# EAGLE design me433_hw2 (EAGLE 8.1.0)
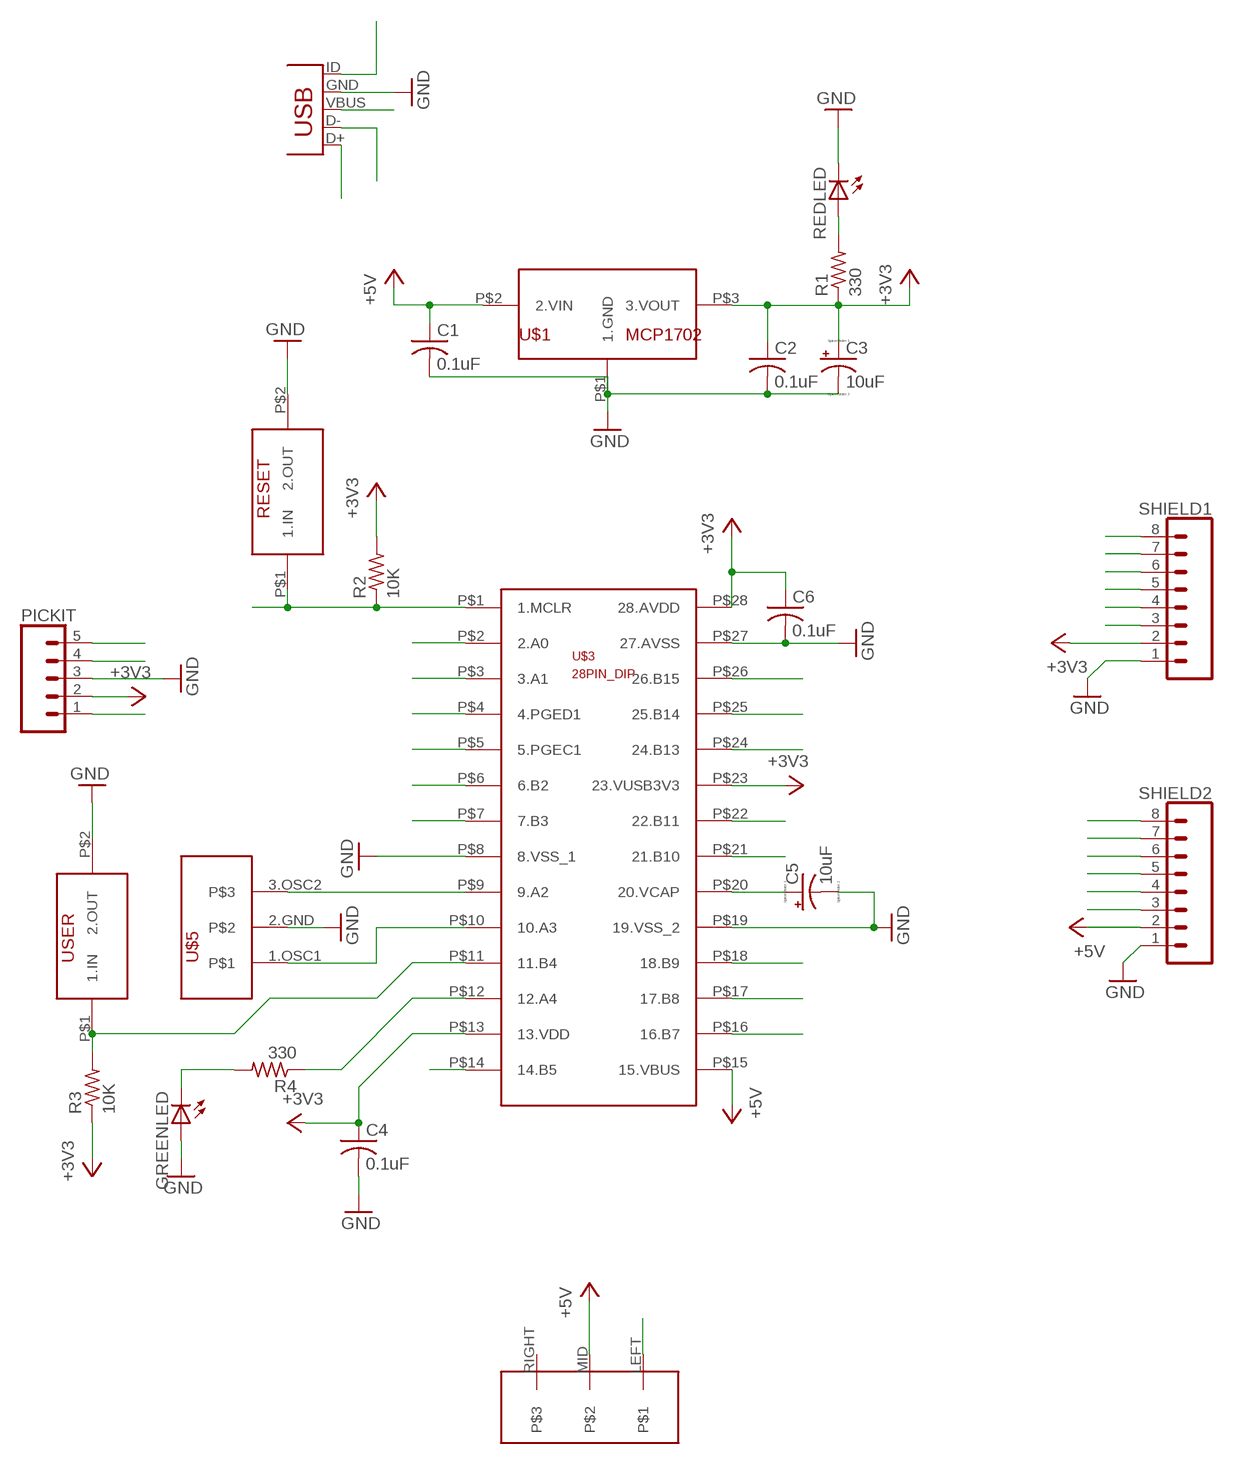
[diagram p0: schematic, sheet 1]

## Parts
C1  0.1uF  C-US025-030X050  [C025-030X050]
C2  0.1uF  C-US025-030X050  [C025-030X050]
C3  10uF  CPOL-USB45181B  [B45181B]
C4  0.1uF  C-US025-030X050  [C025-030X050]
C5  10uF  CPOL-USB45181B  [B45181B]
C6  0.1uF  C-US025-030X050  [C025-030X050]
GREENLED  LED3MM  [LED3MM]
PICKIT  CONN_05  [1X05]
R1  330  R-US_0207/10  [0207/10]
R2  10K  R-US_0207/10  [0207/10]
R3  10K  R-US_0207/10  [0207/10]
R4  330  R-US_0207/10  [0207/10]
REDLED  LED3MM  [LED3MM]
RESET  PUSH_BUTTON  [PUSH_BUTTON]
SHIELD1  CONN_08"  [1X08]
SHIELD2  CONN_08"  [1X08]
U$1  MCP1702  [MCP1702]
U$2  USBMINIB  [USB-MB-H]
U$3  28PIN_DIP  [28PIN_DIP]
U$4  SLIDE_SWITCH  [SLIDE_SWITCH]
U$5  RESONATOR  [RESONATOR]
USER  PUSH_BUTTON  [PUSH_BUTTON]

## Nets
+3V3: C2.1 C3.+ C4.1 C6.1 PICKIT.2 R1.1 R2.2 R3.1 SHIELD1.2 U$1.P$3(3.VOUT) U$3.P$13(13.VDD) U$3.P$23(23.VUSB3V3) U$3.P$28(28.AVDD)
+5V: C1.1 SHIELD2.2 U$1.P$2(2.VIN) U$3.P$15(15.VBUS) U$4.MID
A0: SHIELD1.8 U$3.P$2(2.A0)
A1: SHIELD1.7 U$3.P$3(3.A1)
A4: R4.1 SHIELD1.3 U$3.P$12(12.A4)
B2: SHIELD1.6 U$3.P$6(6.B2)
B3: SHIELD1.5 U$3.P$7(7.B3)
B4: R3.2 SHIELD1.4 U$3.P$11(11.B4) USER.P$1(1.IN)
B7: SHIELD2.3 U$3.P$16(16.B7)
B8: SHIELD2.4 U$3.P$17(17.B8)
B9: SHIELD2.5 U$3.P$18(18.B9)
B13: SHIELD2.6 U$3.P$24(24.B13)
B14: SHIELD2.7 U$3.P$25(25.B14)
B15: SHIELD2.8 U$3.P$26(26.B15)
D+: U$2.D+ U$3.P$21(21.B10)
D-: U$2.D- U$3.P$22(22.B11)
GND: C1.2 C2.2 C3.- C4.2 C5.- C6.2 GREENLED.A PICKIT.3 REDLED.K(C) RESET.P$2(2.OUT) SHIELD1.1 SHIELD2.1 U$1.P$1(1.GND) U$2.GND U$3.P$8(8.VSS_1) U$3.P$19(19.VSS_2) U$3.P$27(27.AVSS) U$5.2.GND USER.P$2(2.OUT)
MCLR: PICKIT.1 R2.1 RESET.P$1(1.IN) U$3.P$1(1.MCLR)
N$1: R1.2 REDLED.A
N$2: U$3.P$9(9.A2) U$5.3.OSC2
N$3: U$3.P$10(10.A3) U$5.1.OSC1
N$4: C5.+ U$3.P$20(20.VCAP)
N$6: GREENLED.K(C) R4.2
PGC1: PICKIT.5 U$3.P$5(5.PGEC1)
PGD1: PICKIT.4 U$3.P$4(4.PGED1)
SLIDESWITCH: U$2.VBUS U$4.LEFT
USBID: U$2.ID(USBID) U$3.P$14(14.B5)
Unconnected: U$4.RIGHT

## Library data of the parts
C1 C2 C4 C6 = resistor:C-US: CAPACITOR, American symbol
C3 C5 = resistor:CPOL-US: POLARIZED CAPACITOR, American symbol
GREENLED REDLED = led:LED: LED OSRAM: - CHIPLED LG R971, LG N971, LY N971, LG Q971, LY Q971, LO R971, LY R971 LH N974, LH R974 LS Q976, LO Q976, LY Q976 LO Q996 - Hyper CHIPLED LW Q18S LB Q993, LB Q99A, LB R99A - SideLED LS A670, LO A670, LY A670, LG A670, LP A670 LB A673, LV A673, LT A673, LW A673 LH A674 LY A675 LS A676, LA A676, LO A676, LY A676, LW A676 LS A679, LY A679, LG A679 - Hyper Micro SIDELED® LS Y876, LA Y876, LO Y876, LY Y876 LT Y87S - SmartLED LW L88C, LW L88S LB L89C, LB L89S, LG L890 LS L89K, LO L89K, LY L89K LS L896, LA L896, LO L896, LY L896 - TOPLED LS T670, LO T670, LY T670, LG T670, LP T670 LSG T670, LSP T670, LSY T670, LOP T670, LYG T670 LG T671, LOG T671, LSG T671 LB T673, LV T673, LT T673, LW T673 LH T674 LS T676, LA T676, LO T676, LY T676, LB T676, LH T676, LSB T676, LW T676 LB T67C, LV T67C, LT T67C, LS T67K, LO T67K, LY T67K, LW E67C LS E67B, LA E67B, LO E67B, LY E67B, LB E67C, LV E67C, LT E67C LW T67C LS T679, LY T679, LG T679 LS T770, LO T770, LY T770, LG T770, LP T770 LB T773, LV T773, LT T773, LW T773 LH T774 LS E675, LA E675, LY E675, LS T675 LS T776, LA T776, LO T776, LY T776, LB T776 LHGB T686 LT T68C, LB T68C - Hyper Mini TOPLED® LB M676 - Mini TOPLED Santana® LG M470 LS M47K, LO M47K, LY M47K Source: http://www.osram.convergy.de LUXEON: - LUMILED® LXK2-PW12-R00, LXK2-PW12-S00, LXK2-PW14-U00, LXK2-PW14-V00 LXK2-PM12-R00, LXK2-PM12-S00, LXK2-PM14-U00 LXK2-PE12-Q00, LXK2-PE12-R00, LXK2-PE12-S00, LXK2-PE14-T00, LXK2-PE14-U00 LXK2-PB12-K00, LXK2-PB12-L00, LXK2-PB12-M00, LXK2-PB14-N00, LXK2-PB14-P00, LXK2-PB14-Q00 LXK2-PR12-L00, LXK2-PR12-M00, LXK2-PR14-Q00, LXK2-PR14-R00 LXK2-PD12-Q00, LXK2-PD12-R00, LXK2-PD12-S00 LXK2-PH12-R00, LXK2-PH12-S00 LXK2-PL12-P00, LXK2-PL12-Q00, LXK2-PL12-R00 Source: www.luxeon.com KINGBRIGHT: KA-3528ASYC Source: www.kingbright.com
PICKIT = SparkFun-Connectors:CONN_05: Multi connection point. Often used as Generic Header-pin footprint for 0.1 inch spaced/style header connections On any of the 0.1 inch spaced packages, you can populate with these: Break Away Headers - Straight <https://www.sparkfun.com/products/116> (PRT-00116) Break Away Male Headers - Right Angle <https://www.sparkfun.com/products/553> (PRT-00553) Female Headers <https://www.sparkfun.com/products/115> (PRT-00115) Break Away Headers - Machine Pin <https://www.sparkfun.com/products/117> (PRT-00117) Break Away Female Headers - Swiss Machine Pin <https://www.sparkfun.com/products/743> (PRT-00743) For SCREWTERMINALS and SPRING TERMINALS visit here: Screw Terimnals on SparkFun.com <https://www.sparkfun.com/search/results?term=Screw+Terminals> (5mm/3.5mm/2.54mm spacing) This device is also useful as a general connection point to wire up your design to another part of your project. Our various solder wires solder well into these plated through hole pads. Hook-Up Wire - Assortment (Stranded, 22 AWG) <https://www.sparkfun.com/products/11375> (PRT-11375) Hook-Up Wire - Assortment (Solid Core, 22 AWG) <https://www.sparkfun.com/products/11367> (PRT-11367) View the entire wire category on our website here <https://www.sparkfun.com/categories/141> Special notes: Molex polarized connector foot print use with SKU : PRT-08231 with associated crimp pins and housings. 1MM SMD Version SKU: PRT-10208
R1-R4 = resistor:R-US_: RESISTOR, American symbol
RESET USER = push_button:PUSH_BUTTON
SHIELD1 SHIELD2 = SparkFun-Connectors:CONN_08: Multi connection point. Often used as Generic Header-pin footprint for 0.1 inch spaced/style header connections On any of the 0.1 inch spaced packages, you can populate with these: Break Away Headers - Straight <https://www.sparkfun.com/products/116> (PRT-00116) Break Away Male Headers - Right Angle <https://www.sparkfun.com/products/553> (PRT-00553) Female Headers <https://www.sparkfun.com/products/115> (PRT-00115) Break Away Headers - Machine Pin <https://www.sparkfun.com/products/117> (PRT-00117) Break Away Female Headers - Swiss Machine Pin <https://www.sparkfun.com/products/743> (PRT-00743) Arduino Stackable Header - 8 Pin <https://www.sparkfun.com/products/9279> (PRT-09279) For SCREWTERMINALS and SPRING TERMINALS visit here: Screw Terimnals on SparkFun.com <https://www.sparkfun.com/search/results?term=Screw+Terminals> (5mm/3.5mm/2.54mm spacing) This device is also useful as a general connection point to wire up your design to another part of your project. Our various solder wires solder well into these plated through hole pads. Hook-Up Wire - Assortment (Stranded, 22 AWG) <https://www.sparkfun.com/products/11375> (PRT-11375) Hook-Up Wire - Assortment (Solid Core, 22 AWG) <https://www.sparkfun.com/products/11367> (PRT-11367) View the entire wire category on our website here <https://www.sparkfun.com/categories/141> Special notes: Molex polarized connector foot print use with SKU : PRT-08231 with associated crimp pins and housings. 1MM SMD Version SKU: PRT-10208 NOTES ON THE VARIANTS LOCK and LOCK_LONGPADS... This footprint was designed to help hold the alignment of a through-hole component (i.e. 6-pin header) while soldering it into place. You may notice that each hole has been shifted either up or down by 0.005 of an inch from it's more standard position (which is a perfectly straight line). This slight alteration caused the pins (the squares in the middle) to touch the edges of the holes. Because they are alternating, it causes a "brace" to hold the component in place. 0.005 has proven to be the perfect amount of "off-center" position when using our standard breakaway headers. Although looks a little odd when you look at the bare footprint, once you have a header in there, the alteration is very hard to notice. Also,if you push a header all the way into place, it is covered up entirely on the bottom side.; PROD_ID: CONN-08438
U$1 = MCP1702:MCP1702
U$2 = usbminib:USBMINIB
U$3 = PIC32:28PIN_DIP
U$4 = slide_switch:SLIDE_SWITCH
U$5 = resonator:RESONATOR

## Board
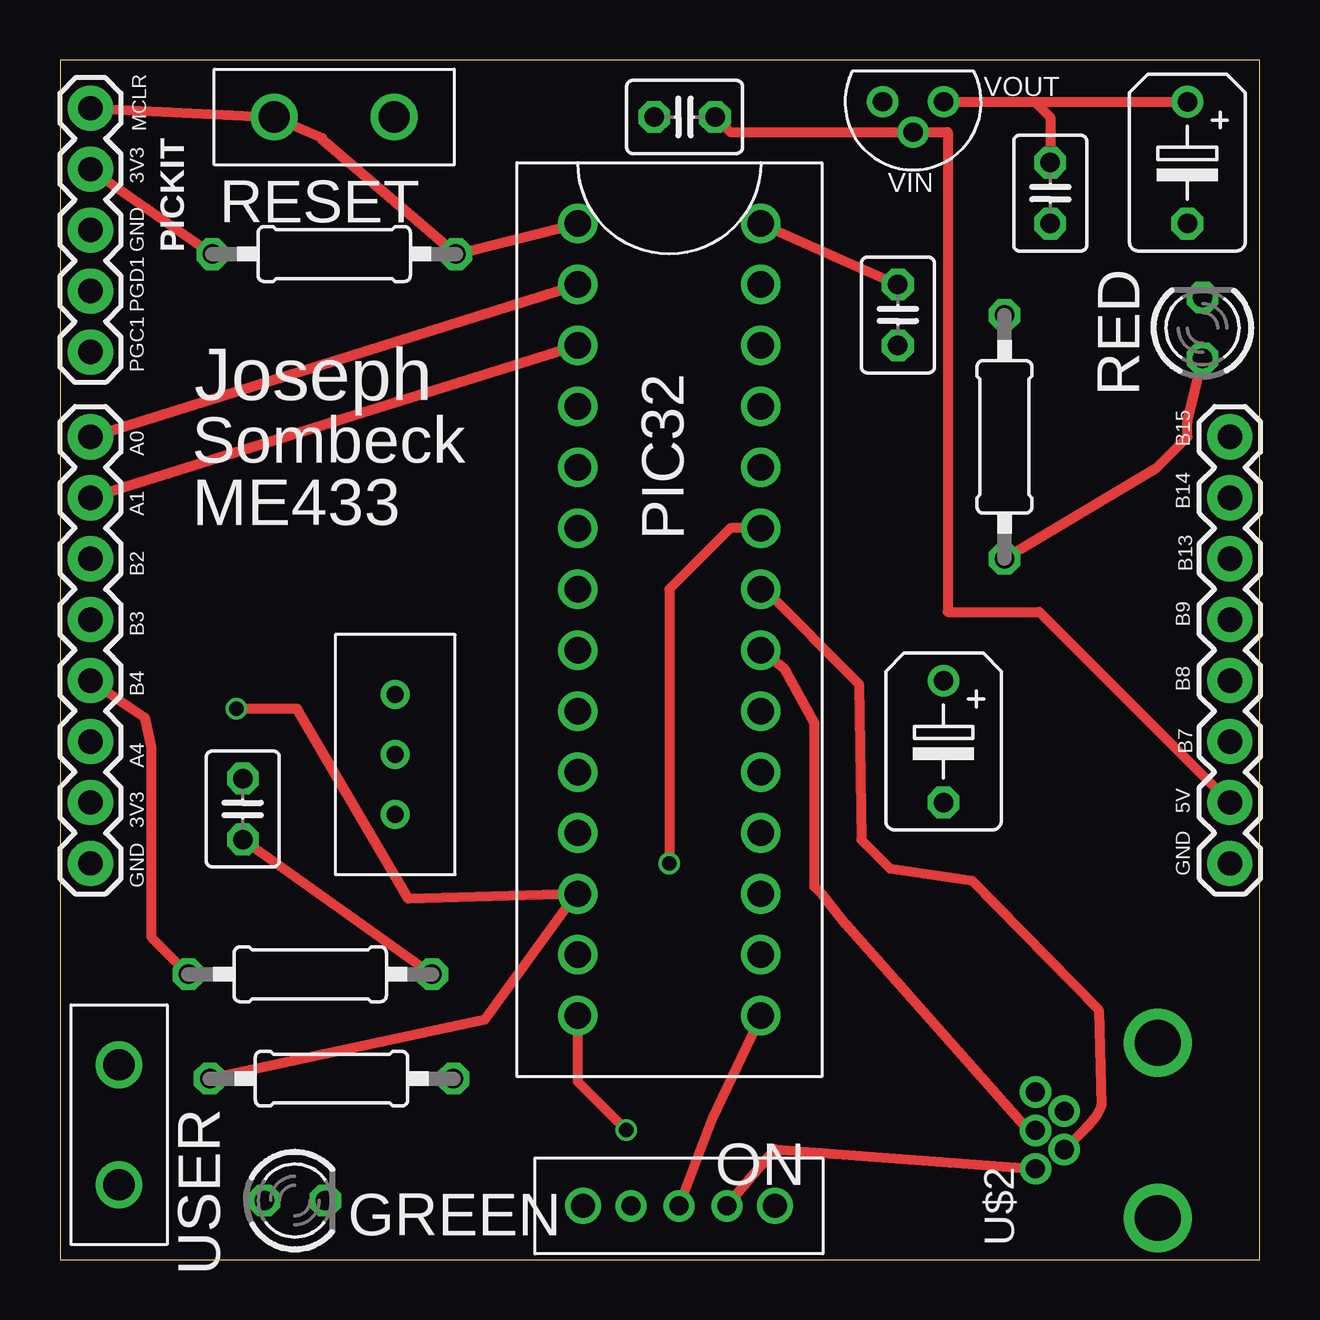
[diagram p1: board, top side]
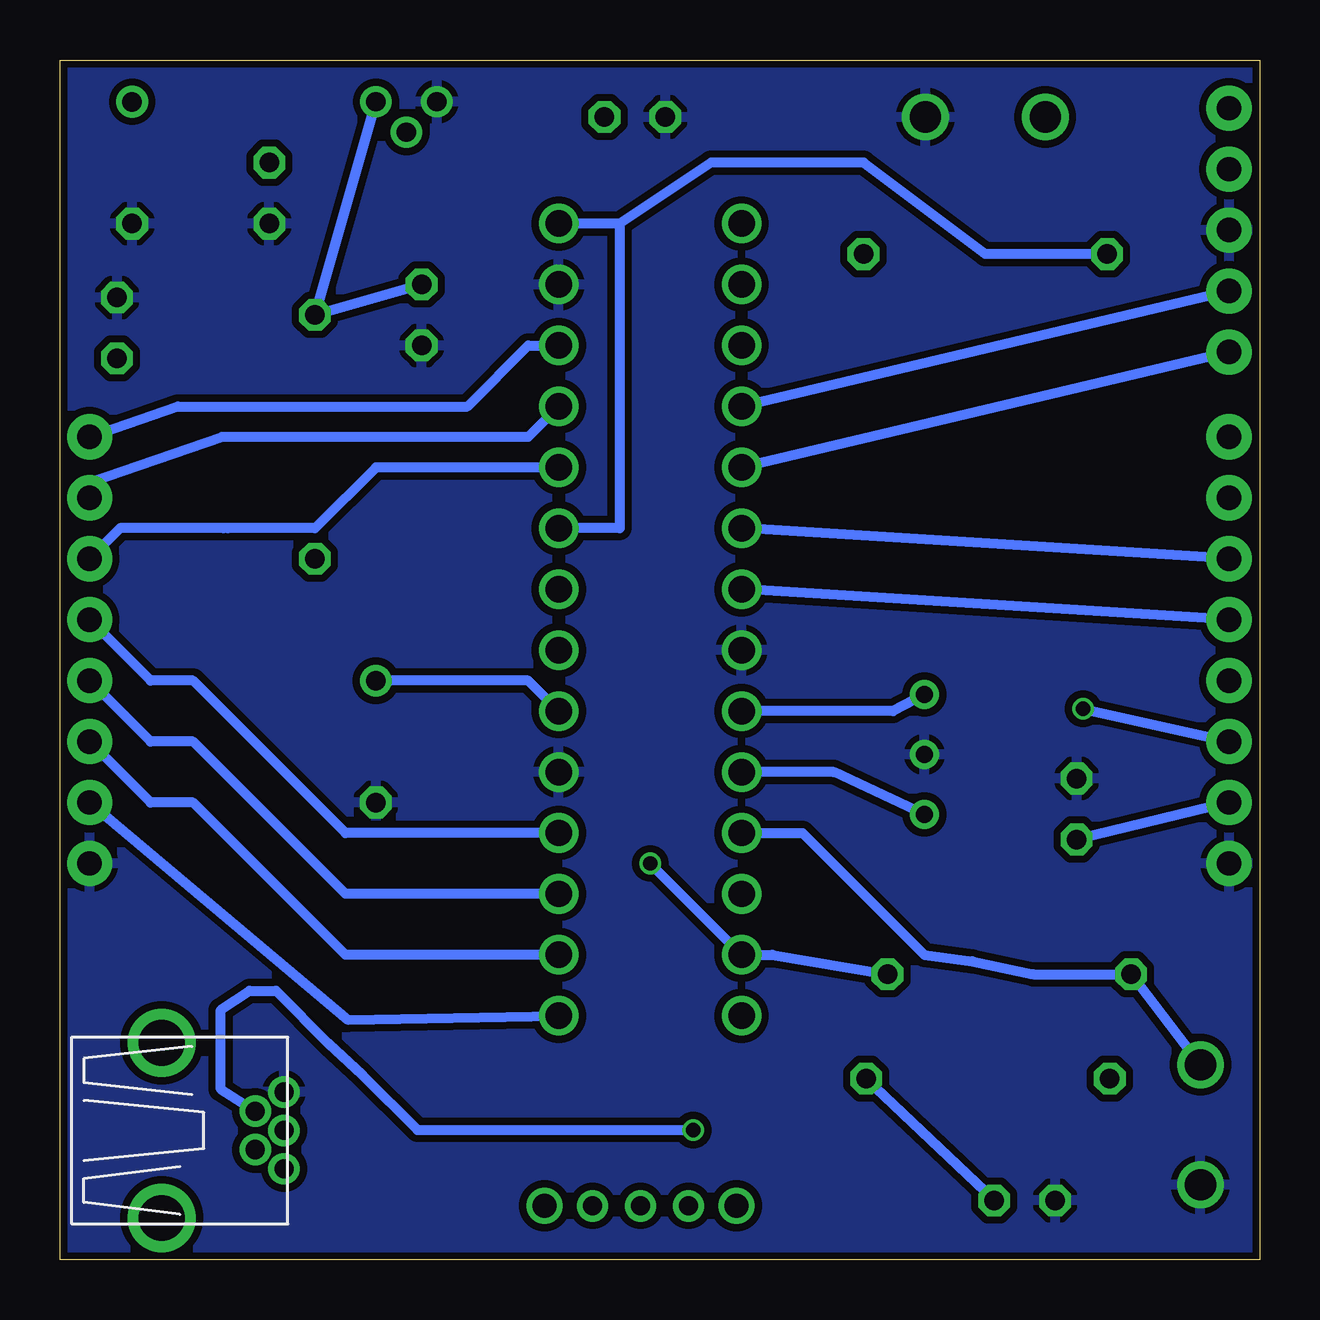
[diagram p2: board, bottom side, seen from below]

Size 50 x 50 mm. Coordinates in mm from the lower left corner, seen from the top.
Outline: 0,0 50,0 50,50 0,50 0,0
Copper layers (1*16): Top 0.035mm / dielectric 1.5mm / Bottom 0.035mm
Design rules "SeeedStudio_2layer_DRU_no_angle_20140221": minimum track width 6mil, minimum drill 12mil, track to track 6mil, track to pad 6mil, pad to pad 6mil, via to via 6mil, smd to smd 0mil, copper to edge 10mil, drill to drill 10mil, minimum pad ring 10mil, minimum via ring 6mil, stop-mask expansion 2mil, vias tented up to drill 100mil, thermal gap 10mil

### Footprints (pad centres in the part's own frame; a part is rotated, then mirrored left to right if it is on the bottom)
C025-030X050 = drill 0.813 octagon: 1 -1.27,0; 2 1.27,0
B45181B = drill 0.813: + -2.54,0 | drill 0.813 octagon: - 2.54,0
LED3MM = drill 0.813 octagon: A -1.27,0; K 1.27,0
1X05 = drill 1.016 pad 1.88: 1 0,0; 2 2.54,0; 3 5.08,0; 4 7.62,0; 5 10.16,0
0207/10 = drill 0.813 octagon: 1 -5.08,0; 2 5.08,0
PUSH_BUTTON = drill 1.3: P$1 -2.5,0; P$2 2.5,0
1X08 = drill 1.016 pad 1.88: 1 0,0; 2 2.54,0; 3 5.08,0; 4 7.62,0; 5 10.16,0; 6 12.7,0; 7 15.24,0; 8 17.78,0
MCP1702 = drill 0.8: P$1 -1.27,1.27; P$2 0,0; P$3 1.27,1.27
USB-MB-H = drill 0.8: D+ 5.1,0; D- 3.9,0.8; GND 5.1,-1.6; ID 3.9,-0.8; VBUS 5.1,1.6 | drill 1.9: P$6 0,-3.65; P$7 0,3.65
28PIN_DIP = drill 1.1: P$1 -16.51,-3.81; P$2 -13.97,-3.81; P$3 -11.43,-3.81; P$4 -8.89,-3.81; P$5 -6.35,-3.81; P$6 -3.81,-3.81; P$7 -1.27,-3.81; P$8 1.27,-3.81; P$9 3.81,-3.81; P$10 6.35,-3.81; P$11 8.89,-3.81; P$12 11.43,-3.81; P$13 13.97,-3.81; P$14 16.51,-3.81; P$15 16.51,3.81; P$16 13.97,3.81; P$17 11.43,3.81; P$18 8.89,3.81; P$19 6.35,3.81; P$20 3.81,3.81; P$21 1.27,3.81; P$22 -1.27,3.81; P$23 -3.81,3.81; P$24 -6.35,3.81; P$25 -8.89,3.81; P$26 -11.43,3.81; P$27 -13.97,3.81; P$28 -16.51,3.81
SLIDE_SWITCH = drill 0.8: LEFT -2,0; MID 0,0; RIGHT 2,0 | drill 1: P$4 4,0; P$5 -4,0
RESONATOR = drill 0.7: 1.OSC1 -2.5,0; 2.GND 0,0; 3.OSC2 2.5,0

### Placement (x,y rotation side)
C1  26.04,47.62 180 top
C2  41.27,44.45 270 top
C3  46.99,45.72 270 top
C4  7.62,18.78 90 top
C5  36.83,21.59 270 top
C6  34.92,39.37 270 top
GREENLED  9.79,2.46 0 top
PICKIT  1.27,47.99 270 top
R1  39.37,34.29 270 top
R2  11.43,41.91 180 top
R3  10.43,11.89 180 top
R4  11.32,7.54 0 top
REDLED  47.62,38.83 90 top
RESET  11.43,47.62 0 top
SHIELD1  1.27,16.51 90 top
SHIELD2  48.77,16.51 90 top
U$1  35.56,46.99 0 top
U$2  45.76,5.38 180 top
U$3  25.4,26.67 270 top
U$4  25.8,2.23 180 top
U$5  13.97,21.05 90 top
USER  2.46,5.62 270 top

### Tracks (layer width: path | path; a pad name or v marks a point on that pad's centre or on a via)
+3V3  (via drill 0.6)
  Top 0.406: U$1.P$3 40.64,48.26 | 40.64,48.26 C3.+ | PICKIT.2 R2.2 | 40.64,48.26 41.27,47.62 C2.1 | U$3.P$23 27.94,30.48 25.4,27.94 v25.4,16.51 | C4.1 R3.1 | U$3.P$28 C6.1
  Bottom 0.406: 26.67,43.18 U$3.P$28 | 26.67,43.18 26.67,30.48 U$3.P$23 | U$1.P$3 R1.1 C6.1 | v25.4,16.51 U$3.P$13 20.32,12.7 R3.1 | SHIELD1.2 C4.1 | R2.2 11.43,41.91 16.51,45.72 22.86,45.72 26.67,43.18
+5V
  Top 0.406: C1.1 27.94,46.99 U$1.P$2 37,46.99 37,27 40.82,27 SHIELD2.2 | U$3.P$15 27.2,5.9 U$4.MID
  Bottom 0.406: SHIELD2.2 38,10 U$3.P$15
A0
  Top 0.406: SHIELD1.8 U$3.P$2
A1
  Top 0.406: U$3.P$3 SHIELD1.7
A4  (via drill 0.6)
  Top 0.406: U$3.P$12 21.5,15.24 | 21.5,15.24 14.53,15.04 9.89,22.95 v7.35,22.95 | 21.5,15.24 17.7,10 R4.1
  Bottom 0.406: v7.35,22.95 SHIELD1.3
B2
  Bottom 0.406: SHIELD1.6 U$3.P$6
B3
  Bottom 0.406: SHIELD1.5 U$3.P$7
B4
  Top 0.406: SHIELD1.4 3.54,22.59 3.81,21.32 3.81,13.43 R3.2
  Bottom 0.406: U$3.P$11 19.05,17.78 13.97,12.7 11.97,12.43 9.43,11.89 R3.2 USER.P$1
B7
  Bottom 0.406: U$3.P$16 38.1,12.7 44.45,19.05 46.23,19.05 SHIELD2.3
B8
  Bottom 0.406: U$3.P$17 38.1,15.24 44.45,21.59 46.23,21.59 SHIELD2.4
B9
  Bottom 0.406: U$3.P$18 38.1,17.78 44.45,24.13 46.23,24.13 SHIELD2.5
B13
  Bottom 0.406: U$3.P$24 36.83,33.02 39.37,30.48 43,30.48 | 43,30.48 43.18,30.48 | 43,30.48 47.5,30.48 SHIELD2.6
B14
  Bottom 0.406: U$3.P$25 30.48,34.29 43.25,34.29 48.77,32.39 SHIELD2.7
B15
  Bottom 0.406: SHIELD2.8 45.09,35.56 33.02,35.56 30.48,38.1 U$3.P$26
D+
  Top 0.406: U$2.D+ 40.64,5.08 32.75,13.97 31.75,15.24 31.44,15.55 31.44,22.37 30.21,24.6 U$3.P$21
D-
  Top 0.406: U$3.P$22 29.36,27.94 33.3,24 33.4,17.5 34.6,16.3 38,15.8 43.3,10.4 43.4,6.4 43.2,6 42.78,5.5 U$2.D-
GND
  pour Bottom (isolate 0.305): 0,50 50,50 50,0 0,0
MCLR
  Top 0.406: U$3.P$1 R2.1 10.89,46.72 10.93,46.76 RESET.P$1 PICKIT.1
N$1
  Top 0.406: R1.2 45.72,33.02 46.99,34.29 46.99,34.92 REDLED.A
N$2
  Bottom 0.406: U$5.3.OSC2 15.28,22.86 U$3.P$9
N$3
  Bottom 0.406: U$5.1.OSC1 17.74,20.32 U$3.P$10
N$4
  Bottom 0.406: U$3.P$20 30.48,24.13 C5.+
N$6
  Bottom 0.406: R4.2 GREENLED.K
PGC1
  Bottom 0.406: PICKIT.5 U$3.P$5
PGD1
  Bottom 0.406: PICKIT.4 U$3.P$4
SLIDESWITCH
  Top 0.406: U$4.LEFT 29.8,4.6 U$2.VBUS
USBID  (via drill 0.6)
  Top 0.406: v23.6,5.4 21.59,7.41 U$3.P$14
  Bottom 0.406: U$2.ID 43.3,7.1 43.3,10.4 42.1,11.2 41,11.2 38.8,9 37.4,7.7 35.1,5.4 v23.6,5.4

### Text on the board
tNames: VOUT | MCLR | 3V3 | RESET | VIN | GND | PGD1 | PGC1 | Joseph | RED | A0 | B15 | Sombeck | A1 | ME433 | B14 | PIC32 | B13 | B2 | B3 | B9 | B4 | B8 | B7 | A4 | 5V | 3V3 | GND | GND | USER | ON | GREEN